# EAGLE schematic IDP Shield (EAGLE 9.6.0)
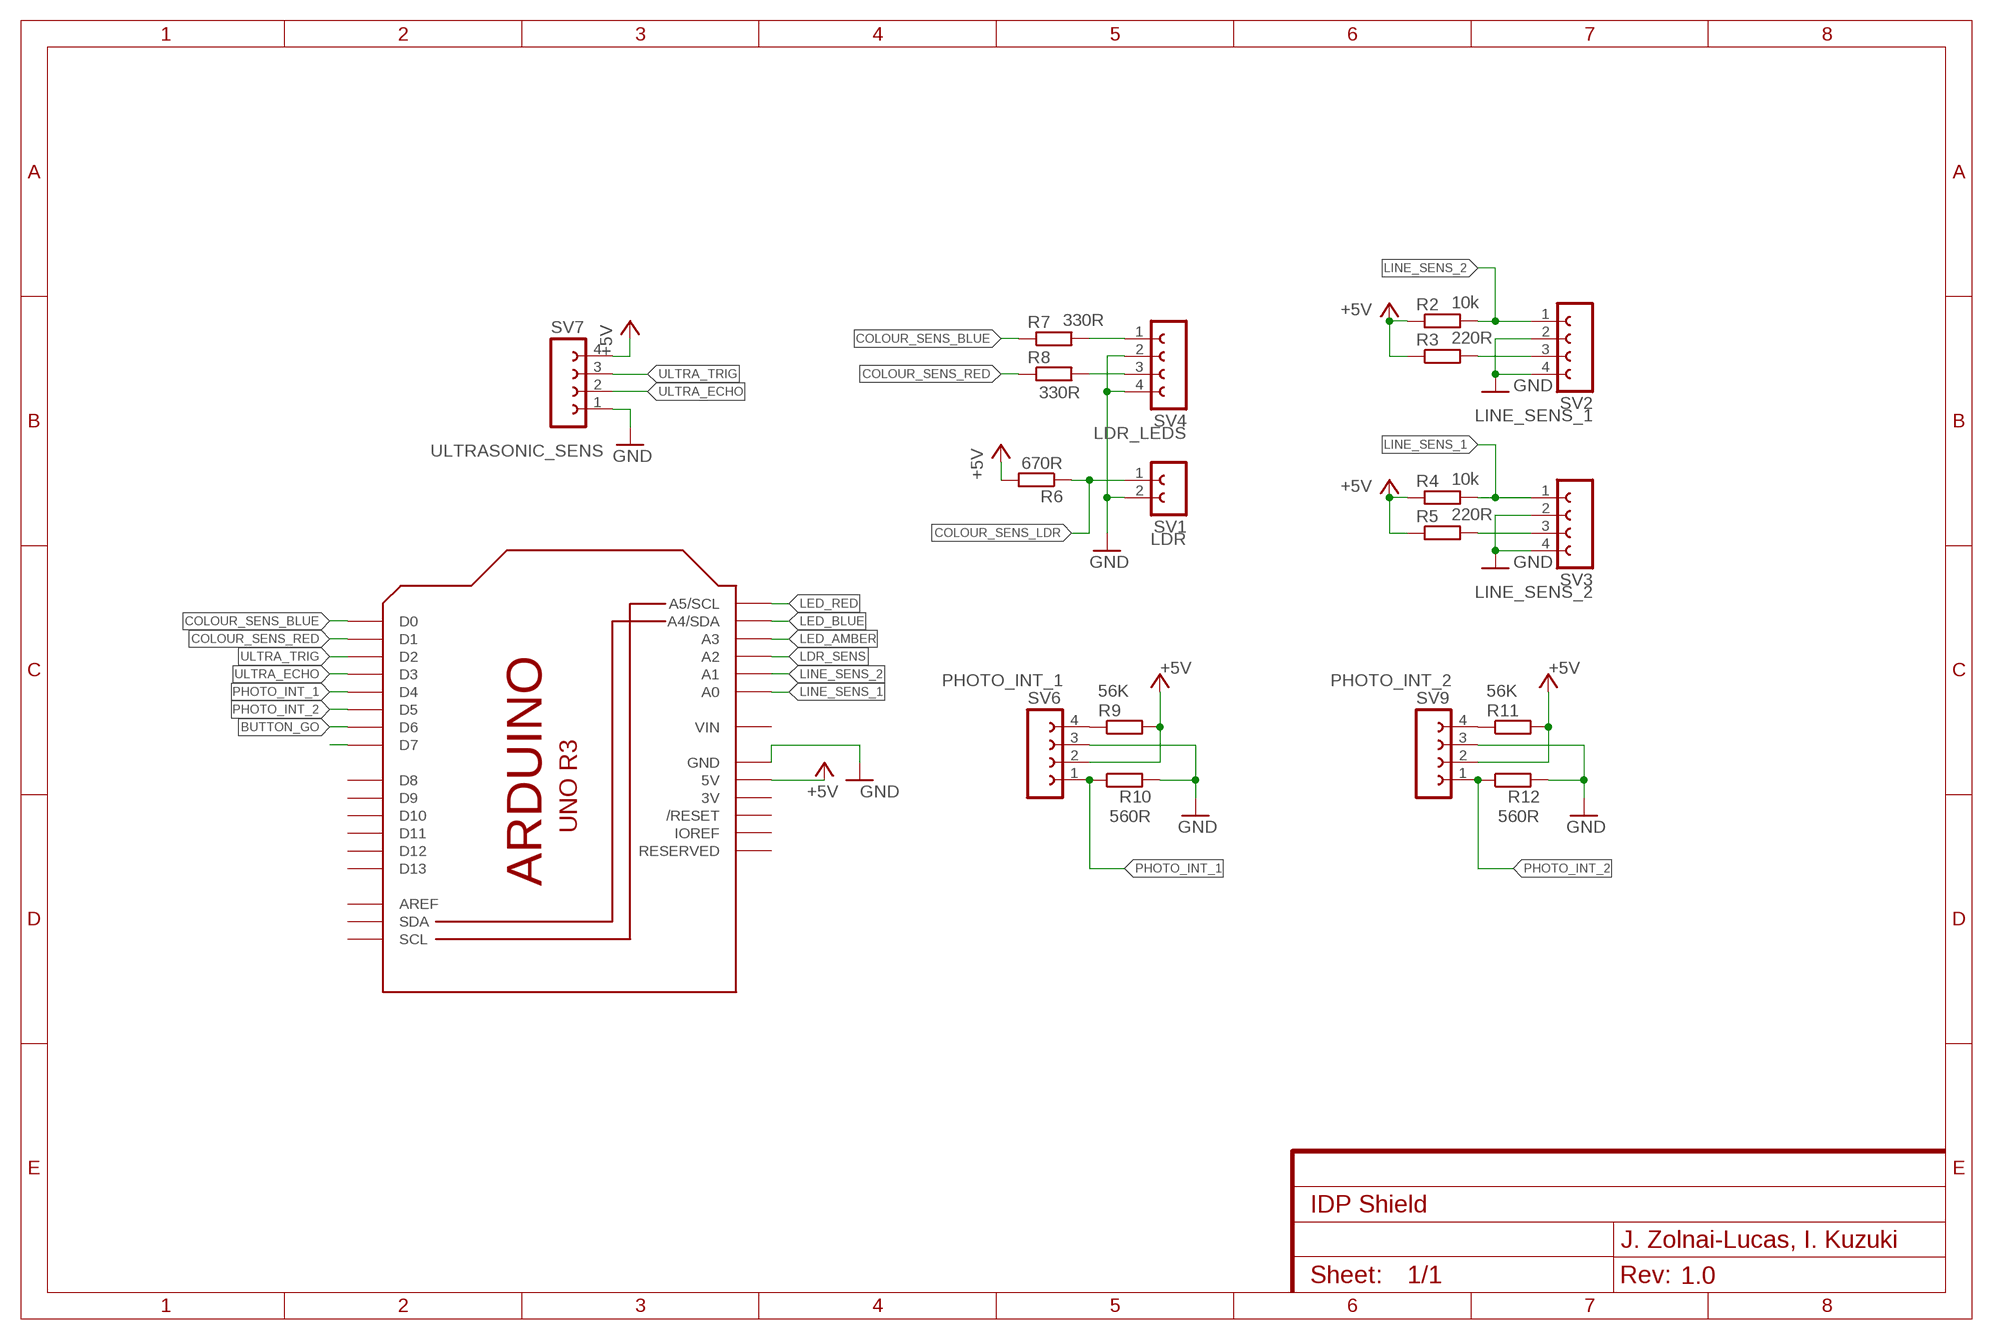
[diagram p0: schematic, sheet 1]
FRAME1 (FRAME-A4L): CREVISION: 1.0; DESIGNER: J. Zolnai-Lucas, I. Kuzuki

## Parts
M1  IDP_PROTOBOARD  [IDP_PROTO]
R2  10k  R-EU_0207/10  [0207/10]
R3  220R  R-EU_0207/10  [0207/10]
R4  10k  R-EU_0207/10  [0207/10]
R5  220R  R-EU_0207/10  [0207/10]
R6  670R  R-EU_0207/10  [0207/10]
R7  330R  R-EU_0207/10  [0207/10]
R8  330R  R-EU_0207/10  [0207/10]
R9  56K  R-EU_0207/10  [0207/10]
R10  560R  R-EU_0207/10  [0207/10]
R11  56K  R-EU_0207/10  [0207/10]
R12  560R  R-EU_0207/10  [0207/10]
SV1  LDR  FE02-1  [FE02-1]
SV2  LINE_SENS_1  FE04-1  [FE04-1]
SV3  LINE_SENS_2  FE04-1  [FE04-1]
SV4  LDR_LEDS  FE04-1  [FE04-1]
SV6  PHOTO_INT_1  FE04-1  [FE04-1]
SV7  ULTRASONIC_SENS  FE04-1  [FE04-1]
SV9  PHOTO_INT_2  FE04-1  [FE04-1]

## Nets
+5V: M1.5V M1.5V@0(5V) M1.5V@1(5V) M1.5V@2(5V) M1.5V@3(5V) M1.5V@4(5V) M1.5V@5(5V) M1.5V@6(5V) M1.5V@7(5V) M1.5V@8(5V) M1.5V@9(5V) M1.5V@10(5V) M1.5V@11(5V) M1.5V@12(5V) M1.5V@13(5V) M1.5V@14(5V) M1.5V@15(5V) M1.5V@16(5V) M1.5V@17(5V) M1.5V@18(5V) M1.5V@19(5V) M1.5V@20(5V) M1.5V@21(5V) M1.5V@22(5V) M1.5V@23(5V) M1.5V@24(5V) M1.5V@25(5V) M1.5V@26(5V) M1.5V@27(5V) M1.5V@28(5V) M1.5V@29(5V) M1.5V@30(5V) M1.5V@31(5V) M1.5V@32(5V) M1.5V@33(5V) M1.5V@34(5V) M1.5V@35(5V) M1.5V@36(5V) M1.5V@37(5V) M1.5V@38(5V) M1.5V@39(5V) M1.5V@40(5V) R2.1 R3.1 R4.1 R5.1 R6.2 R9.2 R11.2 SV6.2 SV7.4 SV9.2
BUTTON_GO: M1.D6
COLOUR_SENS_BLUE: M1.D0 R7.1
COLOUR_SENS_LDR: R6.1 SV1.1
COLOUR_SENS_RED: M1.D1 R8.1
GND: M1.GND M1.GND16(GND) M1.GND17(GND) M1.GND18(GND) M1.GND19(GND) M1.GND20(GND) M1.GND21(GND) M1.GND22(GND) M1.GND23(GND) M1.GND24(GND) M1.GND25(GND) M1.GND@1(GND) M1.GND@2(GND) M1.GND@3(GND) M1.GND@4(GND) M1.GND@5(GND) M1.GND@6(GND) M1.GND@7(GND) M1.GND@8(GND) M1.GND@9(GND) M1.GND@10(GND) M1.GND@11(GND) M1.GND@12(GND) M1.GND@13(GND) M1.GND@14(GND) M1.GND@15(GND) M1.GND@26(GND) M1.GND@27(GND) M1.GND@28(GND) M1.GND@29(GND) M1.GND@30(GND) M1.GND@31(GND) M1.GND@32(GND) M1.GND@33(GND) M1.GND@34(GND) M1.GND@35(GND) M1.GND@36(GND) M1.GND@37(GND) M1.GND@38(GND) M1.GND@39(GND) M1.GND@40(GND) M1.GND@41(GND) M1.GND@42(GND) M1.GND@43(GND) M1.GND@44(GND) M1.GND@45(GND) M1.GND@46(GND) M1.GND@47(GND) M1.GND@48(GND) R10.2 R12.2 SV1.2 SV2.2 SV2.4 SV3.2 SV3.4 SV4.2 SV4.4 SV6.3 SV7.1 SV9.3
LDR_SENS: M1.A2
LED_AMBER: M1.A3
LED_BLUE: M1.A4(A4/SDA)
LED_RED: M1.A5(A5/SCL)
LINE_SENS_1: M1.A0 R4.2 SV3.1
LINE_SENS_2: M1.A1 R2.2 SV2.1
N$1: R7.2 SV4.1
N$2: R3.2 SV2.3
N$3: R8.2 SV4.3
N$4: R5.2 SV3.3
N$6: M1.D7
N$8: R9.1 SV6.4
N$11: R11.1 SV9.4
PHOTO_INT_1: M1.D4 R10.1 SV6.1
PHOTO_INT_2: M1.D5 R12.1 SV9.1
ULTRA_ECHO: M1.D3 SV7.2
ULTRA_TRIG: M1.D2 SV7.3
Unconnected: M1.AREF M1.D8 M1.D9 M1.D10 M1.D11 M1.D12 M1.D13 M1.IOREF M1.RESERVED M1.RESET(/RESET) M1.SCL M1.SDA M1.VIN

## Power pins joined to a net without a drawn wire
3V: M1.3V

## Library data of the parts
M1 = IDP_library:IDP_PROTOBOARD
R2-R12 = IDP_library:R-EU_: RESISTOR, European symbol; SPICEPREFIX: R
SV1 = IDP_library:FE02-1: FEMALE HEADER 2 pin
SV2-SV4 SV6 SV7 SV9 = IDP_library:FE04-1: FEMALE HEADER 4 pin